# EAGLE board BMSBoard (EAGLE 9.1.3)
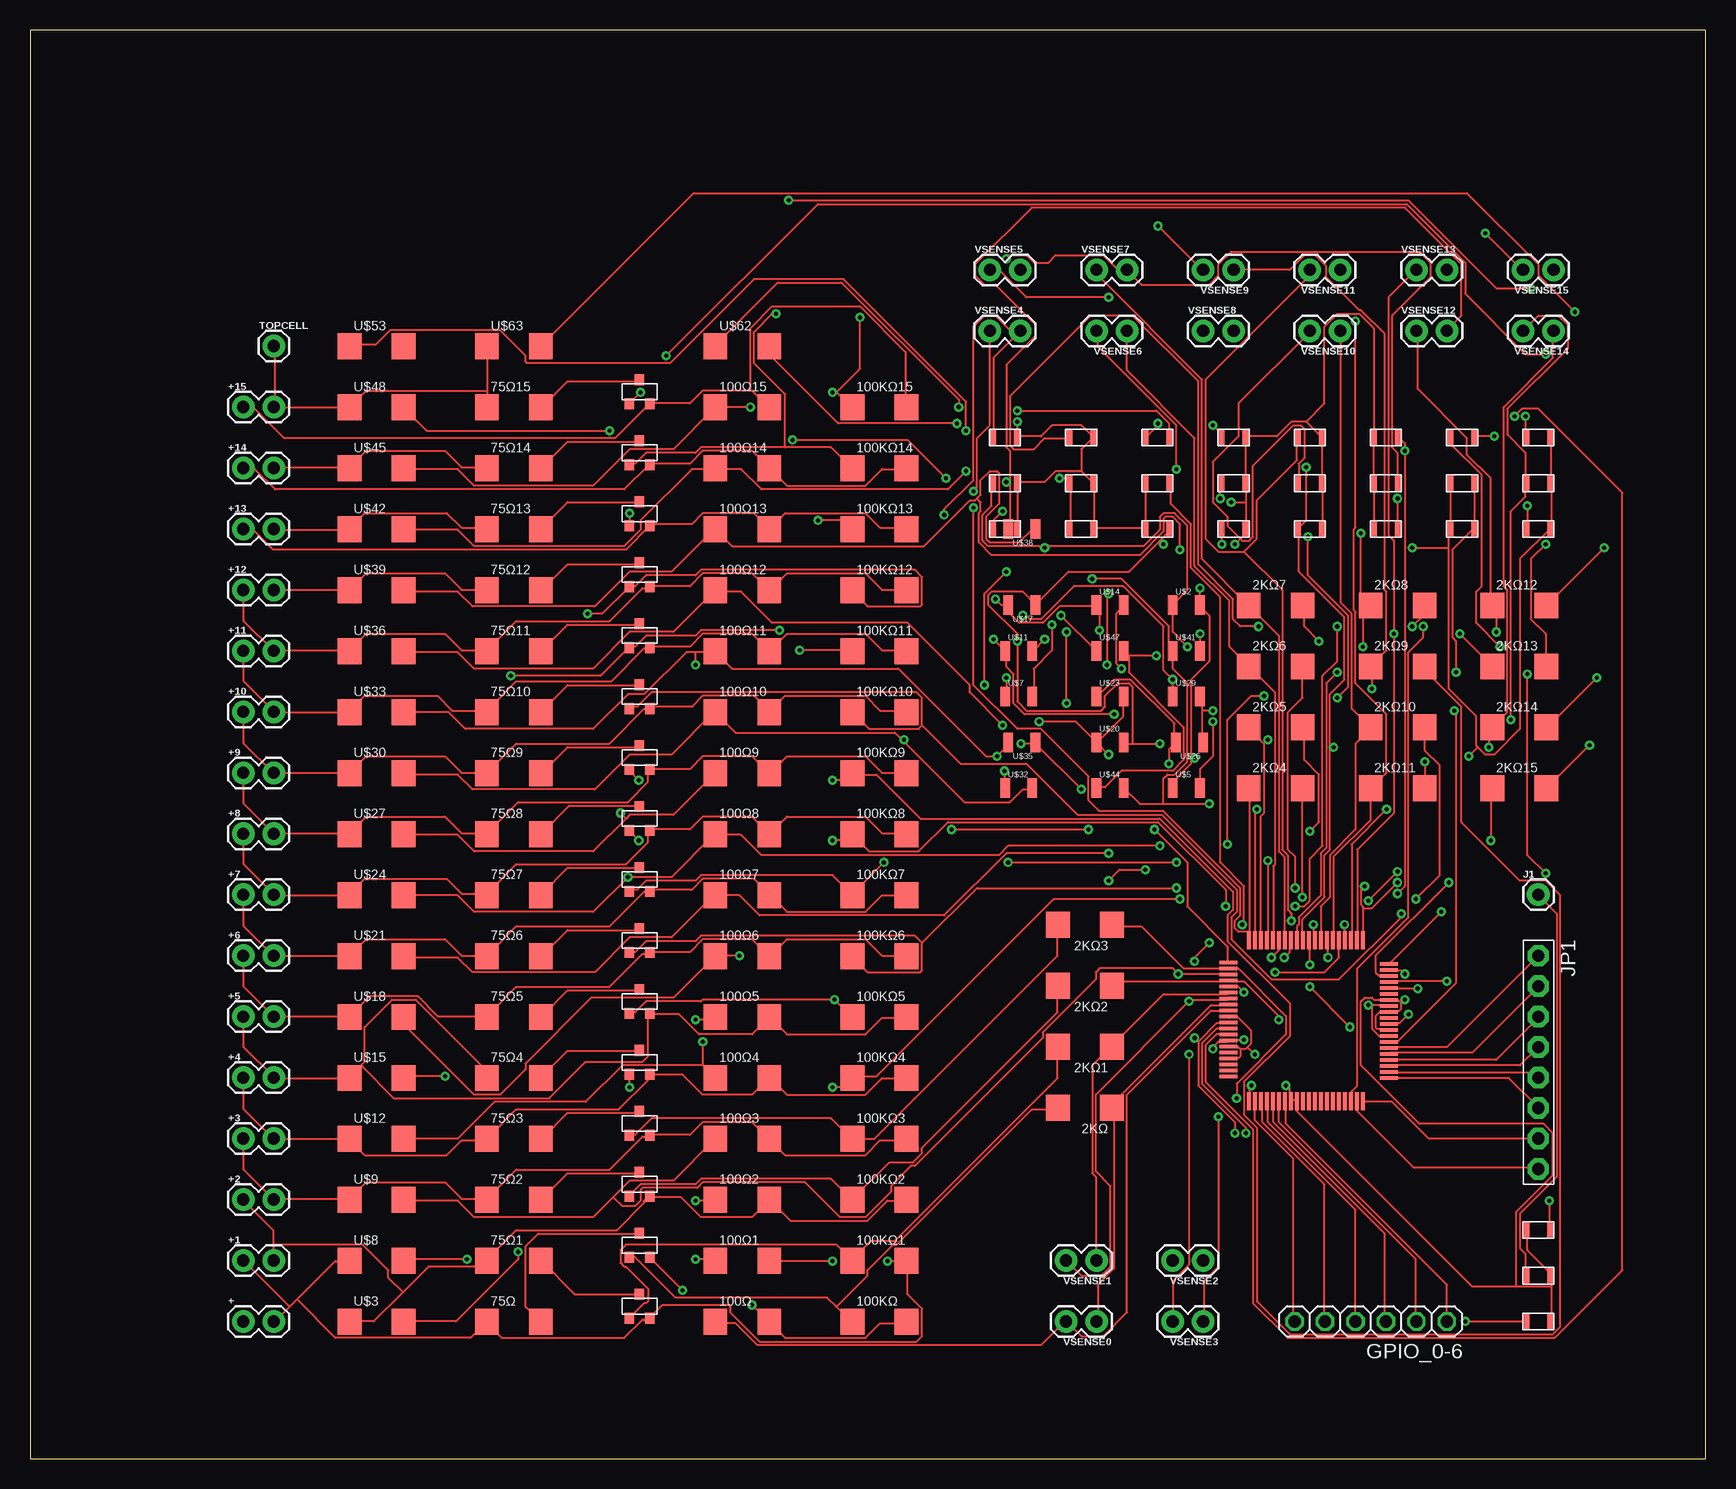
[diagram p2: board, top side]
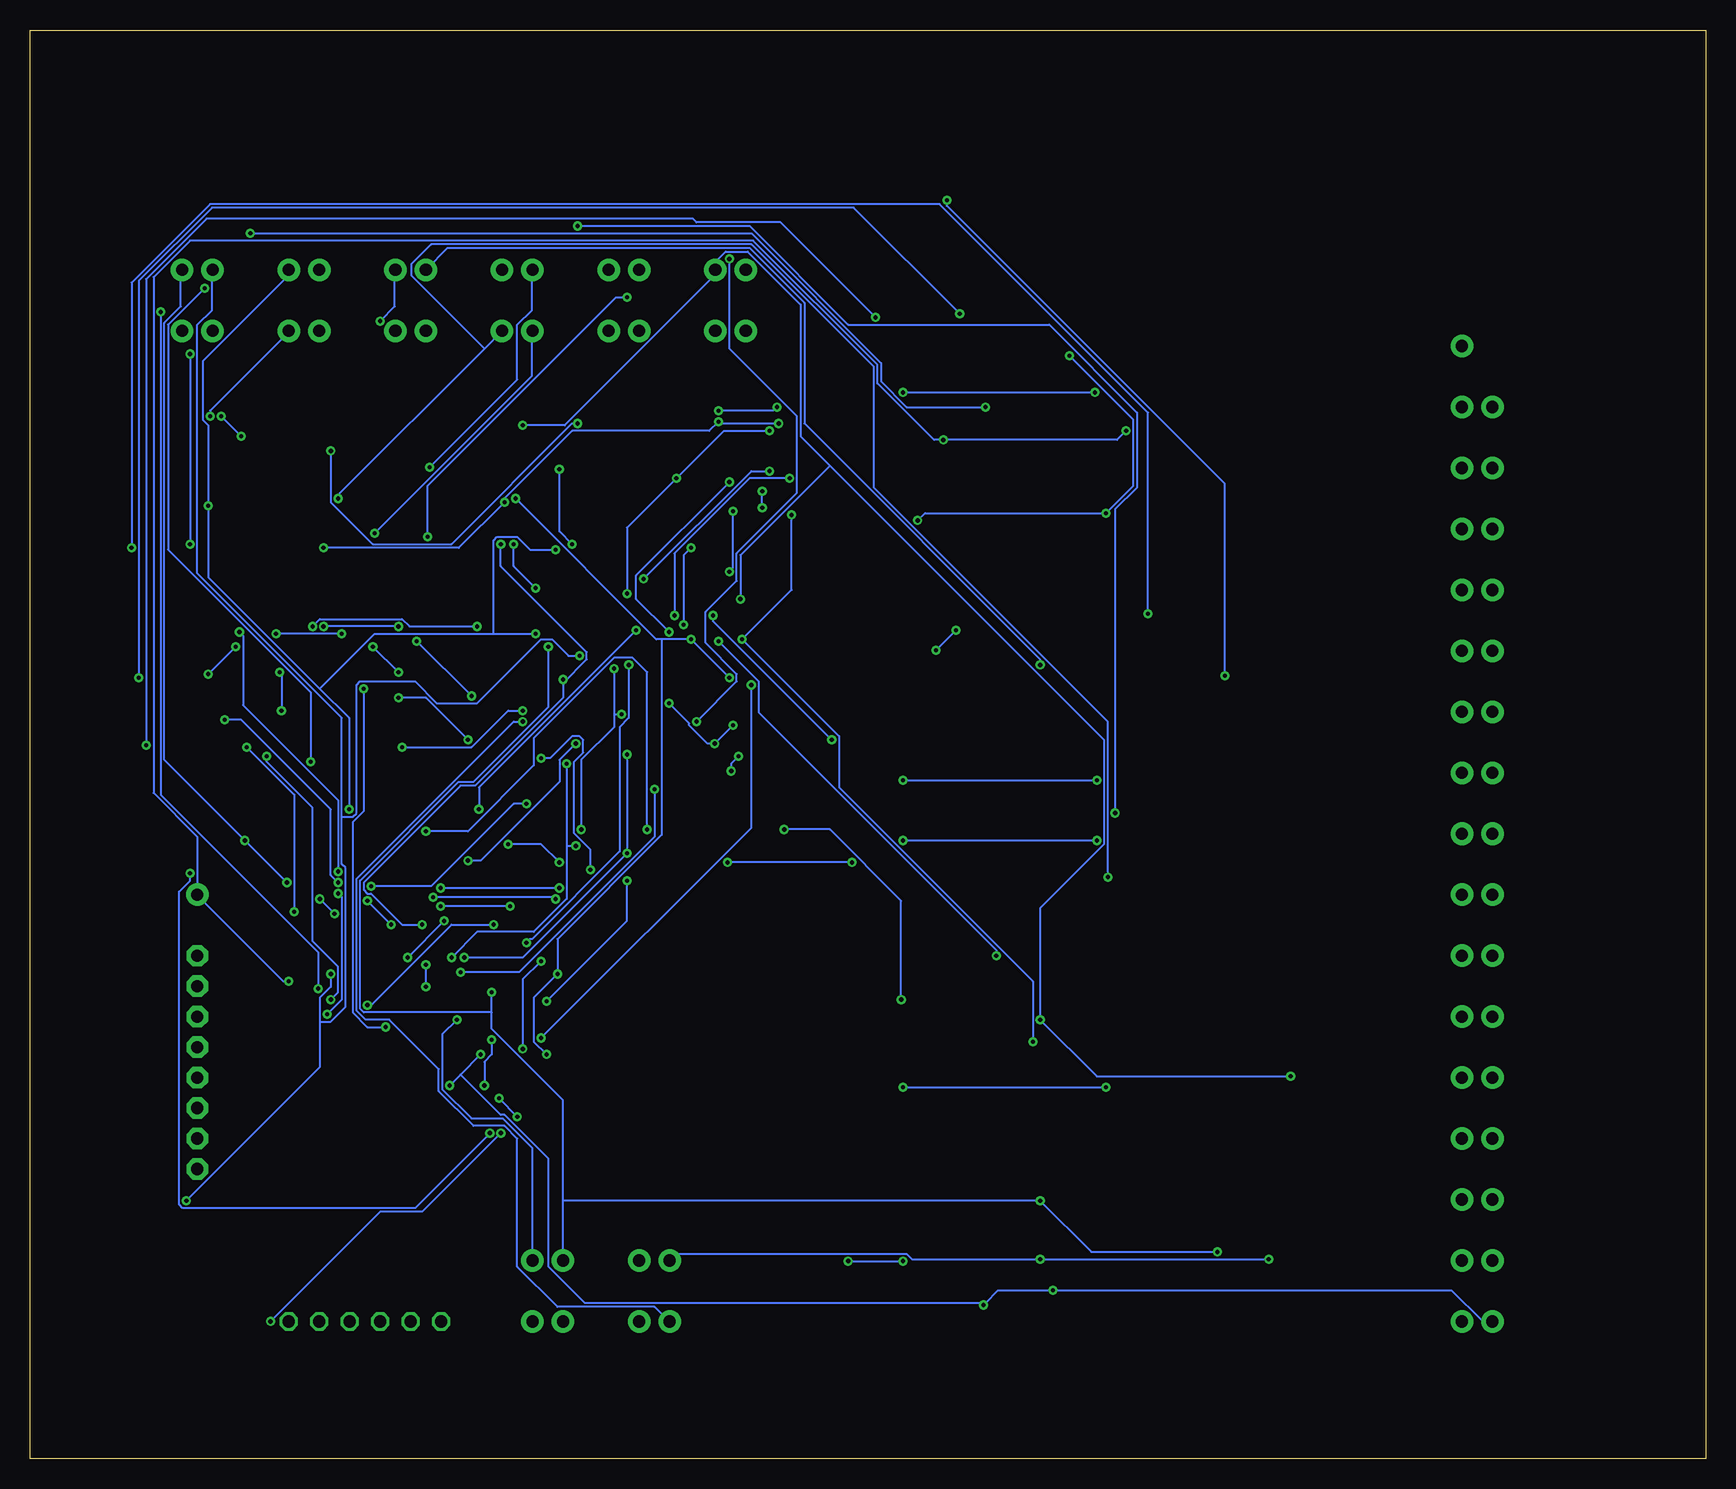
[diagram p3: board, bottom side, seen from below]

Size 139.68 x 119.05 mm. Coordinates in mm from the lower left corner, seen from the top.
Outline: 0,0 139.68,0 139.68,119.05 0,119.05 0,0
Copper layers (1*16): Top 0.035mm / dielectric 1.5mm / Bottom 0.035mm
Design rules "default": minimum track width 6mil, minimum drill 0.35mm, track to track 6mil, track to pad 6mil, pad to pad 6mil, via to via 6mil, smd to smd 6mil, copper to edge 40mil, drill to drill 6mil, minimum pad ring 10mil, minimum via ring 8mil, stop-mask expansion 4mil, vias tented up to drill 0mil, thermal gap 10mil

## Footprints (pad centres in the part's own frame; a part is rotated, then mirrored left to right if it is on the bottom)
CL21B105KBFNNNG = smd 0.5 x 1.35: P$1 -1,0; P$2 1,0
PWR3014W1000JE = smd 1.98 x 2.16: P$1 -0.02,-0.03; P$2 4.48,-0.03
1X02 = drill 1.016 pad 1.88: 1 0,0; 2 2.54,0
1X06 = drill 1.016 octagon: 1 -6.35,0; 2 -3.81,0; 3 -1.27,0; 4 1.27,0; 5 3.81,0; 6 6.35,0
1X01 = drill 1.016 pad 1.88: 1 0,0
1X08-BIG = drill 1.016 pad 1.778 octagon: 1 -8.89,0; 2 -6.35,0; 3 -3.81,0; 4 -1.27,0; 5 1.27,0; 6 3.81,0; 7 6.35,0; 8 8.89,0
2V7002KT1G = smd 0.8 x 0.9: P$1 -0.85,-1; P$2 0,1; P$3 0.85,-1
SOD-123-2 = smd 0.81 x 1.62: P$1 0,0; P$2 2.27,0
BQ76PL455A-Q1 = smd 1.5 x 0.3: P$1 0,9.5; P$2 0,9; P$3 0,8.5; P$4 0,8; P$5 0,7.5; P$6 0,7; P$7 0,6.5; P$8 0,6; P$9 0,5.5; P$10 0,5; P$11 0,4.5; P$12 0,4; P$13 0,3.5; P$14 0,3; P$15 0,2.5; P$16 0,2; P$17 0,1.5; P$18 0,1; P$19 0,0.5; P$20 0,0; P$41 13.4,0; P$42 13.4,0.5; P$43 13.4,1; P$44 13.4,1.5; P$45 13.4,2; P$46 13.4,2.5; P$47 13.4,3; P$48 13.4,3.5; P$49 13.4,4; P$50 13.4,4.5; P$51 13.4,5; P$52 13.4,5.5; P$53 13.4,6; P$54 13.4,6.5; P$55 13.4,7; P$56 13.4,7.5; P$57 13.4,8; P$58 13.4,8.5; P$59 13.4,9; P$60 13.4,9.5 | smd 0.3 x 1.5: P$21 1.85,-1.7; P$22 2.35,-1.7; P$23 2.85,-1.7; P$24 3.35,-1.7; P$25 3.85,-1.7; P$26 4.35,-1.7; P$27 4.85,-1.7; P$28 5.35,-1.7; P$29 5.85,-1.7; P$30 6.35,-1.7; P$31 6.85,-1.7; P$32 7.35,-1.7; P$33 7.85,-1.7; P$34 8.35,-1.7; P$35 8.85,-1.7; P$36 9.35,-1.7; P$37 9.85,-1.7; P$38 10.35,-1.7; P$39 10.85,-1.7; P$40 11.35,-1.7; P$61 11.45,11.65; P$62 10.95,11.65; P$63 10.45,11.65; P$64 9.95,11.65; P$65 9.45,11.65; P$66 8.95,11.65; P$67 8.45,11.65; P$68 7.95,11.65; P$69 7.45,11.65; P$70 6.95,11.65; P$71 6.45,11.65; P$72 5.95,11.65; P$73 5.45,11.65; P$74 4.95,11.65; P$75 4.45,11.65; P$76 3.95,11.65; P$77 3.45,11.65; P$78 2.95,11.65; P$79 2.45,11.65; P$80 1.95,11.65

## Placement (x,y rotation side)
1UF  1uF  [CL21B105KBFNNNG]  100.33,77.47 0 top
1UF1  1uF  [CL21B105KBFNNNG]  81.28,81.28 0 top
1UF2  1uF  [CL21B105KBFNNNG]  100.33,81.28 0 top
1UF3  1uF  [CL21B105KBFNNNG]  81.28,85.09 0 top
1UF4  1uF  [CL21B105KBFNNNG]  100.33,85.09 0 top
1UF5  1uF  [CL21B105KBFNNNG]  93.98,77.47 180 top
1UF6  1uF  [CL21B105KBFNNNG]  113.03,81.28 180 top
1UF7  1uF  [CL21B105KBFNNNG]  113.03,77.47 180 top
1UF8  1uF  [CL21B105KBFNNNG]  106.68,77.47 0 top
1UF9  1uF  [CL21B105KBFNNNG]  106.68,81.28 0 top
1UF10  1uF  [CL21B105KBFNNNG]  106.68,85.09 0 top
1UF11  1uF  [CL21B105KBFNNNG]  125.73,85.09 0 top
1UF12  1uF  [CL21B105KBFNNNG]  125.73,77.47 0 top
1UF13  1uF  [CL21B105KBFNNNG]  125.73,81.28 0 top
1UF14  1uF  [CL21B105KBFNNNG]  125.73,19.05 180 top
1UF15  1uF  [CL21B105KBFNNNG]  125.73,15.24 0 top
2KΩ  2kΩ  [PWR3014W1000JE]  90.17,29.21 180 top
2KΩ1  2kΩ  [PWR3014W1000JE]  90.17,34.29 180 top
2KΩ2  2kΩ  [PWR3014W1000JE]  90.17,39.37 180 top
2KΩ3  2kΩ  [PWR3014W1000JE]  90.17,44.45 180 top
2KΩ4  2kΩ  [PWR3014W1000JE]  101.6,55.88 0 top
2KΩ5  2kΩ  [PWR3014W1000JE]  101.6,60.96 0 top
2KΩ6  2kΩ  [PWR3014W1000JE]  101.6,66.04 0 top
2KΩ7  2kΩ  [PWR3014W1000JE]  101.6,71.12 0 top
2KΩ8  2kΩ  [PWR3014W1000JE]  111.76,71.12 0 top
2KΩ9  2kΩ  [PWR3014W1000JE]  111.76,66.04 0 top
2KΩ10  2kΩ  [PWR3014W1000JE]  111.76,60.96 0 top
2KΩ11  2kΩ  [PWR3014W1000JE]  111.76,55.88 0 top
2KΩ12  2kΩ  [PWR3014W1000JE]  121.92,71.12 0 top
2KΩ13  2kΩ  [PWR3014W1000JE]  121.92,66.04 0 top
2KΩ14  2kΩ  [PWR3014W1000JE]  121.92,60.96 0 top
2KΩ15  2kΩ  [PWR3014W1000JE]  121.92,55.88 0 top
75Ω  75Ω  [PWR3014W1000JE]  38.1,11.43 0 top
75Ω1  75Ω  [PWR3014W1000JE]  38.1,16.51 0 top
75Ω2  75Ω  [PWR3014W1000JE]  38.1,21.59 0 top
75Ω3  75Ω  [PWR3014W1000JE]  38.1,26.67 0 top
75Ω4  75Ω  [PWR3014W1000JE]  38.1,31.75 0 top
75Ω5  75Ω  [PWR3014W1000JE]  38.1,36.83 0 top
75Ω6  75Ω  [PWR3014W1000JE]  38.1,41.91 0 top
75Ω7  75Ω  [PWR3014W1000JE]  38.1,46.99 0 top
75Ω8  75Ω  [PWR3014W1000JE]  38.1,52.07 0 top
75Ω9  75Ω  [PWR3014W1000JE]  38.1,57.15 0 top
75Ω10  75Ω  [PWR3014W1000JE]  38.1,62.23 0 top
75Ω11  75Ω  [PWR3014W1000JE]  38.1,67.31 0 top
75Ω12  75Ω  [PWR3014W1000JE]  38.1,72.39 0 top
75Ω13  75Ω  [PWR3014W1000JE]  38.1,77.47 0 top
75Ω14  75Ω  [PWR3014W1000JE]  38.1,82.55 0 top
75Ω15  75Ω  [PWR3014W1000JE]  38.1,87.63 0 top
100KΩ  100kΩ  [PWR3014W1000JE]  68.58,11.43 0 top
100KΩ1  100kΩ  [PWR3014W1000JE]  68.58,16.51 0 top
100KΩ2  100kΩ  [PWR3014W1000JE]  68.58,21.59 0 top
100KΩ3  100kΩ  [PWR3014W1000JE]  68.58,26.67 0 top
100KΩ4  100kΩ  [PWR3014W1000JE]  68.58,31.75 0 top
100KΩ5  100kΩ  [PWR3014W1000JE]  68.58,36.83 0 top
100KΩ6  100kΩ  [PWR3014W1000JE]  68.58,41.91 0 top
100KΩ7  100kΩ  [PWR3014W1000JE]  68.58,46.99 0 top
100KΩ8  100kΩ  [PWR3014W1000JE]  68.58,52.07 0 top
100KΩ9  100kΩ  [PWR3014W1000JE]  68.58,57.15 0 top
100KΩ10  100kΩ  [PWR3014W1000JE]  68.58,62.23 0 top
100KΩ11  100kΩ  [PWR3014W1000JE]  68.58,67.31 0 top
100KΩ12  100kΩ  [PWR3014W1000JE]  68.58,72.39 0 top
100KΩ13  100kΩ  [PWR3014W1000JE]  68.58,77.47 0 top
100KΩ14  100kΩ  [PWR3014W1000JE]  68.58,82.55 0 top
100KΩ15  100kΩ  [PWR3014W1000JE]  68.58,87.63 0 top
100Ω  100Ω  [PWR3014W1000JE]  57.15,11.43 0 top
100Ω1  100Ω  [PWR3014W1000JE]  57.15,16.51 0 top
100Ω2  100Ω  [PWR3014W1000JE]  57.15,21.59 0 top
100Ω3  100Ω  [PWR3014W1000JE]  57.15,26.67 0 top
100Ω4  100Ω  [PWR3014W1000JE]  57.15,31.75 0 top
100Ω5  100Ω  [PWR3014W1000JE]  57.15,36.83 0 top
100Ω6  100Ω  [PWR3014W1000JE]  57.15,41.91 0 top
100Ω7  100Ω  [PWR3014W1000JE]  57.15,46.99 0 top
100Ω8  100Ω  [PWR3014W1000JE]  57.15,52.07 0 top
100Ω9  100Ω  [PWR3014W1000JE]  57.15,57.15 0 top
100Ω10  100Ω  [PWR3014W1000JE]  57.15,62.23 0 top
100Ω11  100Ω  [PWR3014W1000JE]  57.15,67.31 0 top
100Ω12  100Ω  [PWR3014W1000JE]  57.15,72.39 0 top
100Ω13  100Ω  [PWR3014W1000JE]  57.15,77.47 0 top
100Ω14  100Ω  [PWR3014W1000JE]  57.15,82.55 0 top
100Ω15  100Ω  [PWR3014W1000JE]  57.15,87.63 0 top
+  -  [1X02]  17.78,11.43 0 top
+1  -  [1X02]  17.78,16.51 0 top
+2  -  [1X02]  17.78,21.59 0 top
+3  -  [1X02]  17.78,26.67 0 top
+4  -  [1X02]  17.78,31.75 0 top
+5  -  [1X02]  17.78,36.83 0 top
+6  -  [1X02]  17.78,41.91 0 top
+7  -  [1X02]  17.78,46.99 0 top
+8  -  [1X02]  17.78,52.07 0 top
+9  -  [1X02]  17.78,57.15 0 top
+10  -  [1X02]  17.78,62.23 0 top
+11  -  [1X02]  17.78,67.31 0 top
+12  -  [1X02]  17.78,72.39 0 top
+13  -  [1X02]  17.78,77.47 0 top
+14  -  [1X02]  17.78,82.55 0 top
+15  -  [1X02]  17.78,87.63 0 top
GPIO_0-6  [1X06]  111.76,11.43 180 top
J1  VSENSE16  [1X01]  125.73,46.99 0 top
JP1  [1X08-BIG]  125.73,33.02 270 top
TOPCELL  [1X01]  20.32,92.71 0 top
U$1  2V7002KT1G  [2V7002KT1G]  50.8,12.7 0 top
U$2  6.2V  [SOD-123-2]  95.25,71.12 0 top
U$3  100Ω  [PWR3014W1000JE]  26.67,11.43 0 top
U$4  2V7002KT1G  [2V7002KT1G]  50.8,17.78 0 top
U$5  6.2V  [SOD-123-2]  95.25,55.88 0 top
U$6  2V7002KT1G  [2V7002KT1G]  50.8,22.86 0 top
U$7  6.2V  [SOD-123-2]  81.28,63.5 0 top
U$8  100Ω  [PWR3014W1000JE]  26.67,16.51 0 top
U$9  100Ω  [PWR3014W1000JE]  26.67,21.59 0 top
U$10  2V7002KT1G  [2V7002KT1G]  50.8,27.94 0 top
U$11  6.2V  [SOD-123-2]  81.28,67.31 0 top
U$12  100Ω  [PWR3014W1000JE]  26.67,26.67 0 top
U$13  2V7002KT1G  [2V7002KT1G]  50.8,33.02 0 top
U$14  6.2V  [SOD-123-2]  88.9,71.12 0 top
U$15  100Ω  [PWR3014W1000JE]  26.67,31.75 0 top
U$16  2V7002KT1G  [2V7002KT1G]  50.8,38.1 0 top
U$17  6.2V  [SOD-123-2]  83.82,71.12 180 top
U$18  100Ω  [PWR3014W1000JE]  26.67,36.83 0 top
U$19  2V7002KT1G  [2V7002KT1G]  50.8,43.18 0 top
U$20  6.2V  [SOD-123-2]  88.9,59.69 0 top
U$21  100Ω  [PWR3014W1000JE]  26.67,41.91 0 top
U$22  2V7002KT1G  [2V7002KT1G]  50.8,48.26 0 top
U$23  6.2V  [SOD-123-2]  88.9,63.5 0 top
U$24  100Ω  [PWR3014W1000JE]  26.67,46.99 0 top
U$25  2V7002KT1G  [2V7002KT1G]  50.8,53.34 0 top
U$26  6.2V  [SOD-123-2]  97.79,59.69 180 top
U$27  100Ω  [PWR3014W1000JE]  26.67,52.07 0 top
U$28  2V7002KT1G  [2V7002KT1G]  50.8,58.42 0 top
U$29  6.2V  [SOD-123-2]  95.25,63.5 0 top
U$30  100Ω  [PWR3014W1000JE]  26.67,57.15 0 top
U$31  2V7002KT1G  [2V7002KT1G]  50.8,63.5 0 top
U$32  6.2V  [SOD-123-2]  81.28,55.88 0 top
U$33  100Ω  [PWR3014W1000JE]  26.67,62.23 0 top
U$34  2V7002KT1G  [2V7002KT1G]  50.8,68.58 0 top
U$35  6.2V  [SOD-123-2]  83.82,59.69 180 top
U$36  100Ω  [PWR3014W1000JE]  26.67,67.31 0 top
U$37  2V7002KT1G  [2V7002KT1G]  50.8,73.66 0 top
U$38  6.2V  [SOD-123-2]  83.82,77.47 180 top
U$39  100Ω  [PWR3014W1000JE]  26.67,72.39 0 top
U$40  2V7002KT1G  [2V7002KT1G]  50.8,78.74 0 top
U$41  6.2V  [SOD-123-2]  95.25,67.31 0 top
U$42  100Ω  [PWR3014W1000JE]  26.67,77.47 0 top
U$43  2V7002KT1G  [2V7002KT1G]  50.8,83.82 0 top
U$44  6.2V  [SOD-123-2]  88.9,55.88 0 top
U$45  100Ω  [PWR3014W1000JE]  26.67,82.55 0 top
U$46  2V7002KT1G  [2V7002KT1G]  50.8,88.9 0 top
U$47  6.2V  [SOD-123-2]  88.9,67.31 0 top
U$48  100Ω  [PWR3014W1000JE]  26.67,87.63 0 top
U$49  BQ76PL455A-Q1  [BQ76PL455A-Q1]  101.6,43.18 270 top
U$50  22nF  [CL21B105KBFNNNG]  119.38,85.09 0 top
U$51  CL21B105KBFNNNG  [CL21B105KBFNNNG]  125.73,11.43 0 top
U$52  CL21B105KBFNNNG  [CL21B105KBFNNNG]  81.28,77.47 0 top
U$53  1Ω  [PWR3014W1000JE]  26.67,92.71 0 top
U$54  CL21B105KBFNNNG  [CL21B105KBFNNNG]  87.63,77.47 0 top
U$55  CL21B105KBFNNNG  [CL21B105KBFNNNG]  87.63,81.28 0 top
U$56  CL21B105KBFNNNG  [CL21B105KBFNNNG]  87.63,85.09 0 top
U$57  CL21B105KBFNNNG  [CL21B105KBFNNNG]  119.38,77.47 0 top
U$58  CL21B105KBFNNNG  [CL21B105KBFNNNG]  119.38,81.28 0 top
U$59  CL21B105KBFNNNG  [CL21B105KBFNNNG]  93.98,81.28 0 top
U$60  CL21B105KBFNNNG  [CL21B105KBFNNNG]  113.03,85.09 0 top
U$61  CL21B105KBFNNNG  [CL21B105KBFNNNG]  93.98,85.09 180 top
U$62  PWR3014W1000JE  [PWR3014W1000JE]  57.15,92.71 0 top
U$63  PWR3014W1000JE  [PWR3014W1000JE]  38.1,92.71 0 top
VSENSE0  EQ1  [1X02]  88.9,11.43 180 top
VSENSE1  EQ1  [1X02]  88.9,16.51 180 top
VSENSE2  EQ1  [1X02]  97.79,16.51 180 top
VSENSE3  EQ1  [1X02]  97.79,11.43 180 top
VSENSE4  EQ1  [1X02]  80.01,93.98 0 top
VSENSE5  EQ1  [1X02]  80.01,99.06 0 top
VSENSE6  EQ1  [1X02]  91.44,93.98 180 top
VSENSE7  EQ1  [1X02]  88.9,99.06 0 top
VSENSE8  EQ1  [1X02]  97.79,93.98 0 top
VSENSE9  EQ1  [1X02]  100.33,99.06 180 top
VSENSE10  EQ1  [1X02]  109.22,93.98 180 top
VSENSE11  EQ1  [1X02]  109.22,99.06 180 top
VSENSE12  EQ1  [1X02]  115.57,93.98 0 top
VSENSE13  EQ1  [1X02]  115.57,99.06 0 top
VSENSE14  EQ1  [1X02]  127,93.98 180 top
VSENSE15  EQ1  [1X02]  127,99.06 180 top

## Tracks (layer width: path | path; a pad name or v marks a point on that pad's centre or on a via)
AUX0
  Top 0.152: JP1.1 118.11,34.29 113.39,34.29 U$49.P$66
AUX1
  Top 0.152: U$49.P$65 113.39,33.83 120.24,33.83 125.73,39.32 JP1.2
AUX2
  Top 0.152: U$49.P$64 113.39,33.22 122.22,33.22 125.73,36.73 JP1.3
AUX3
  Top 0.152: JP1.4 124.21,32.77 113.39,32.77 U$49.P$63
AUX4
  Top 0.152: U$49.P$62 113.39,32.16 125.42,32.16 125.73,31.85 JP1.5
AUX5
  Top 0.152: U$49.P$61 113.39,31.7 123.29,31.7 125.73,29.26 JP1.6
AUX6
  Top 0.152: JP1.7 116.59,26.67 113.54,29.72 111.1,29.72 U$49.P$60
AUX7
  Top 0.152: U$49.P$59 110.64,29.72 110.64,28.96 115.37,24.23 125.73,24.23 JP1.8
BATCON1,2
  Top 0.152: 100KΩ4.P$2 73,31.7 71.02,31.7 69.65,30.33 63.09,30.33 61.72,31.7 100Ω4.P$2 61.57,31.7 60.2,30.33 56.08,30.33 54.41,32 51.66,32 U$13.P$3 51.51,32 51.51,31.55 49.07,29.11 40.54,29.11 38.1,26.67 75Ω3.P$1 37.95,26.52 35.97,26.52 34.75,25.3 27.89,25.3 26.67,26.52 U$12.P$1 26.52,26.67 +3.2 20.27,26.67 17.83,29.11 17.83,31.7 +4.1
BATCON2,3
  Top 0.152: 100KΩ8.P$2 73,52.12 71.02,52.12 69.65,53.49 63.09,53.49 61.72,52.12 100Ω8.P$2 61.57,52.12 60.2,53.49 56.08,53.49 55.02,52.43 51.66,52.43 U$25.P$3 51.51,52.27 51.51,51.36 49.68,49.53 40.54,49.53 38.1,47.09 75Ω7.P$1 37.95,47.09 35.97,47.09 34.75,48.31 27.89,48.31 26.67,47.09 U$24.P$1 26.52,46.94 20.42,46.94 +7.2 20.27,47.09 17.83,49.53 17.83,51.97 +8.1
BATCON3,4
  Top 0.152: 100KΩ12.P$2 73,72.39 71.02,72.39 69.65,73.76 63.09,73.76 61.72,72.39 100Ω12.P$2 61.57,72.39 60.2,73.76 56.08,73.76 55.02,72.69 51.66,72.69 U$37.P$3 51.51,72.54 51.05,72.54 48.31,69.8 40.54,69.8 38.1,67.36 75Ω11.P$1 37.95,67.36 35.97,67.36 34.59,68.73 28.04,68.73 26.67,67.36 U$36.P$1 26.52,67.36 20.42,67.36 +11.2 17.83,69.8 17.83,72.39 +12.1
EQ1
  Top 0.152: U$49.P$28 99.82,37.8 98.45,37.8 90.22,29.57 90.22,29.26 2KΩ.P$1 90.22,29.11 90.37,28.96 90.37,15.85 89,14.48 89,11.43 VSENSE0.1
EQ2
  Top 0.152: U$49.P$26 99.82,38.71 94.49,38.71 90.22,34.44 2KΩ1.P$1 90.07,34.29 88.54,32.77 88.54,23.77 88.85,23.47 88.85,16.61 VSENSE1.1
EQ3  (via drill 0.35)
  Top 0.152: 2KΩ2.P$1 90.22,39.47 90.53,39.78 99.82,39.78 U$49.P$24 99.97,39.78 101.19,39.78 104.09,36.88 v104.09,36.58
  Bottom 0.152: v104.09,36.58 105.31,35.36 105.31,30.79 102.87,28.35 100.28,28.35 97.84,25.91 97.84,16.61 VSENSE2.1
EQ4  (via drill 0.35)
  Top 0.152: 2KΩ3.P$1 90.22,44.35 92.66,44.35 96.16,40.84 99.82,40.84 U$49.P$22 99.97,40.84 100.74,40.84 104.7,36.88 104.7,35.36 100.58,31.24 v100.58,30.02 | v99.06,28.5 99.06,16 97.84,14.78 97.84,11.43 VSENSE3.1
  Bottom 0.152: v100.58,30.02 v99.06,28.5
EQ5  (via drill 0.35)
  Top 0.152: 101.65,43.89 101.65,55.78 2KΩ4.P$1 | 101.65,43.89 101.65,43.28 U$49.P$20 101.65,43.89 | VSENSE4.1 80.01,86.11 78.94,85.04 78.94,80.92 v78.64,80.62 | v78.64,79.25 78.64,64.47 82.3,60.81 84.28,60.81 88.24,56.84 88.24,54.86 89.15,53.95 94.49,53.95 100.89,47.55 100.89,45.26 100.43,44.81 100.43,44.2 100.74,43.89 101.65,43.89
  Bottom 0.152: v78.64,79.25 v78.64,80.62
EQ6  (via drill 0.35)
  Top 0.152: 102.87,59.59 102.87,53.8 102.56,53.49 102.56,43.28 U$49.P$18 | 102.87,59.59 101.65,60.81 2KΩ5.P$1 | VSENSE5.1 80.77,99.06 83.06,96.77 v89.92,96.77 | v106.53,76.81 106.53,73.61 109.88,70.26 109.88,64.31 v108.97,63.4 | 102.87,59.59 v103.17,59.89
  Bottom 0.152: v89.92,96.77 90.83,96.77 106.53,81.08 v106.53,76.81 | v108.97,63.4 106.68,63.4 v103.17,59.89
EQ7
  Top 0.152: U$49.P$16 103.63,43.28 103.63,49.38 103.78,49.53 103.78,63.86 101.65,65.99 2KΩ6.P$1 101.5,66.14 99.97,67.67 99.97,71.48 97.08,74.37 97.08,85.04 91.44,90.68 VSENSE6.1
EQ8
  Top 0.152: U$49.P$14 104.55,43.28 104.55,50.14 104.09,50.6 104.09,68.58 101.65,71.02 2KΩ7.P$1 101.5,71.17 97.69,74.98 97.69,89.92 89,98.6 89,99.06 VSENSE7.1
EQ9  (via drill 0.35)
  Top 0.152: v108.97,65.53 108.05,64.62 108.05,50.9 107.59,50.44 107.59,46.94 105.77,45.11 105.77,44.5 105.61,44.35 105.61,43.28 U$49.P$12 | v111.1,67.67 111.1,70.41 111.71,71.02 2KΩ8.P$1 111.71,71.17 110.95,71.93 v110.95,77.11
  Bottom 0.152: v111.1,67.67 v108.97,65.53 | v110.95,77.11 97.84,90.22 97.84,93.88 VSENSE8.1
EQ10  (via drill 0.35)
  Top 0.152: v106.68,41.15 106.68,43.13 U$49.P$10 | v110.03,35.97 v106.68,39.32 | v111.86,64.16 111.86,65.99 2KΩ9.P$1 111.86,66.14 113.08,67.36 113.08,72.24 112.93,72.39 112.93,93.73 110.95,95.71 110.8,95.71 108.05,98.45 108.05,99.36 107.14,100.28 106.22,100.28 105,99.06 VSENSE9.1
  Bottom 0.152: v106.68,39.32 v106.68,41.15 | v110.03,35.97 111.56,35.97 112.78,37.19 112.78,53.03 111.86,53.95 v111.86,64.16
EQ11
  Top 0.152: U$49.P$8 107.59,43.28 107.59,46.02 108.36,46.79 108.36,50.29 110.49,52.43 110.49,59.59 111.71,60.81 2KΩ10.P$1 111.71,60.96 110.19,62.48 110.19,70.41 109.27,71.32 109.27,93.88 VSENSE10.1
EQ12  (via drill 0.35)
  Top 0.152: U$49.P$6 108.66,43.28 108.66,50.14 111.71,53.19 111.71,55.78 2KΩ11.P$1 111.86,55.93 113.08,57.15 113.08,62.03 110.49,64.62 110.49,70.56 110.34,70.71 110.34,77.42 110.49,77.57 v110.49,94.79
  Bottom 0.152: v110.49,94.79 109.27,96.01 109.27,99.06 VSENSE11.1
EQ13  (via drill 0.35)
  Top 0.152: v109.58,44.5 109.58,43.28 U$49.P$4 | v114,48.92 v111.56,46.48 | v122.22,68.89 122.22,70.71 121.92,71.02 2KΩ12.P$1 121.77,71.17 121.77,81.69 119.79,83.67 119.79,85.04 115.67,89.15 115.67,93.88 VSENSE12.1
  Bottom 0.152: v111.56,46.48 v109.58,44.5 | v114,48.92 114,54.86 121.92,62.79 121.92,68.58 v122.22,68.89
EQ14  (via drill 0.35)
  Top 0.152: U$49.P$2 110.64,43.28 110.64,50.75 113.69,53.8 v113.69,68.73 113.69,76.5 113.23,76.96 113.23,96.77 115.52,99.06 VSENSE13.1 | v119.18,68.73 121.77,66.14 2KΩ13.P$1
  Bottom 0.152: v113.69,68.73 v119.18,68.73
EQ15  (via drill 0.35)
  Top 0.152: v117.65,45.57 113.39,41.3 U$49.P$80 | v121.61,59.28 121.61,60.66 121.77,60.81 2KΩ14.P$1 121.92,60.96 123.14,62.18 123.14,72.39 122.83,72.69 122.83,87.63 126.95,91.75 126.95,93.88 VSENSE14.1
  Bottom 0.152: v117.65,45.57 117.65,55.32 v121.61,59.28
EQ16  (via drill 0.35)
  Top 0.152: v118.26,48.01 112.17,41.91 112.17,40.54 112.47,40.23 113.23,40.23 U$49.P$78 | v121.77,51.51 121.77,55.78 2KΩ15.P$1
  Bottom 0.152: v118.26,48.01 v121.77,51.51 128.47,58.22 128.47,94.64 127.1,96.01 127.1,99.06 VSENSE15.1
GND  (via drill 0.35)
  Top 0.152: U$58.P$1 118.42,81.23 118.42,77.57 U$57.P$1 118.26,77.42 118.26,75.89 | 1UF11.P$2 126.8,85.04 126.8,81.38 1UF13.P$2 126.8,81.23 126.8,77.57 1UF12.P$2 126.64,77.42 124.21,74.98 124.21,60.81 122.07,58.67 121.31,58.67 120.7,59.28 | 118.26,75.89 118.26,64.16 120.55,61.87 120.55,59.44 120.7,59.28 | 1UF7.P$2 112.01,77.57 112.01,81.23 1UF6.P$2 112.01,81.38 112.01,85.04 U$60.P$1 112.01,85.19 112.01,94.18 110.8,95.4 108.97,95.4 107.9,94.34 107.9,87.94 106.38,86.41 | 101.35,79.7 101.35,81.23 1UF2.P$2 101.35,81.38 101.35,85.04 1UF4.P$2 101.35,85.19 103.94,85.19 105.16,86.41 106.38,86.41 | 101.35,79.7 101.35,77.57 1UF.P$2 | 1UF8.P$2 107.75,77.57 107.75,81.23 1UF9.P$2 107.75,81.38 107.75,85.04 1UF10.P$2 107.59,85.19 106.38,86.41 | 92.96,77.57 92.96,81.23 U$59.P$1 | U$52.P$2 82.3,77.57 82.3,81.23 1UF1.P$2 82.3,81.38 84.58,81.38 85.5,82.3 87.63,82.3 | 88.7,77.57 88.7,81.23 U$55.P$2 88.54,81.38 87.63,82.3 | 88.7,77.57 92.96,77.57 | 92.96,77.57 1UF5.P$2 | 88.7,77.57 U$54.P$2 | 82.3,85.19 84.28,85.19 85.19,86.11 87.63,86.11 88.54,85.19 U$56.P$2 88.54,85.04 87.63,84.12 87.63,82.3 | v77.27,86.26 67.36,86.26 61.72,91.9 61.72,92.66 U$62.P$2 | 82.3,85.19 v82.3,86.41 | 82.3,85.19 1UF3.P$2 | v100.13,79.7 101.35,79.7 | v115.21,75.89 118.26,75.89 | 100.89,34.14 100.89,33.53 100.74,33.38 99.97,33.38 U$49.P$37 | 100.89,34.14 100.74,34.29 99.97,34.29 U$49.P$35 | 101.5,34.29 101.35,34.14 100.89,34.14 | 101.5,34.29 101.8,34.59 101.8,35.66 100.74,36.73 99.97,36.73 U$49.P$30 | U$49.P$69 113.23,35.81 112.32,35.81 112.17,35.97 112.17,36.88 112.47,37.19 113.23,37.19 U$49.P$72 113.39,37.34 114.15,37.34 114.3,37.49 114.3,37.95
  Top 0.152: 114.3,37.95 114,38.25 113.39,38.25 U$49.P$74 113.23,38.25 112.01,38.25 111.86,38.41 111.25,38.41 110.95,38.1 110.95,32.77 115.82,27.89 126.19,27.89 126.95,27.13 126.95,23.62 123.9,20.57 123.9,14.33 | 126.8,14.33 126.8,15.24 1UF15.P$2 126.64,15.24 126.64,15.54 124.82,17.37 124.82,19.05 1UF14.P$2 | 126.8,14.33 126.8,11.43 U$51.P$2 | 126.8,14.33 123.9,14.33 | 123.9,14.33 120.24,14.33 105.61,28.96 105.61,29.72 U$49.P$49 105.46,29.87 105.16,29.87 U$49.P$48 105,29.87 105,30.79 v104.7,31.09 | v102.11,33.68 101.5,34.29 | v54.41,14.02 51.66,16.76 U$4.P$3 | v60.2,12.8 61.57,11.43 100Ω.P$2 61.72,11.28 62.94,10.06 69.65,10.06 70.87,11.28 73,11.28 100KΩ.P$2 | v119.94,58.52 120.7,59.28 | 114.3,37.95 v114.61,38.25
  Bottom 0.152: v77.27,86.26 82.14,86.26 v82.3,86.41 83.06,85.65 94.49,85.65 100.13,80.01 v100.13,79.7 103.94,75.89 v115.21,75.89 | v104.7,31.09 103.78,32 | 103.78,32 v102.11,33.68 | 60.05,12.95 58.98,14.02 v54.41,14.02 21.18,14.02 18.59,11.43 +.1 | 103.78,32 100.43,28.65 100.13,28.65 96.47,24.99 96.47,16 93.42,12.95 60.05,12.95 | 60.05,12.95 v60.2,12.8 | v119.94,58.52 119.94,58.06 116.13,54.25 116.13,43.13 114,41 114,38.86 v114.61,38.25
N$2
  Top 0.152: 67.21,12.65 68.43,11.43 100KΩ.P$1 | 67.21,12.65 66.45,13.41 53.8,13.41 50.44,16.76 49.99,16.76 U$4.P$1 | 67.21,12.65 69.8,15.24 69.8,15.7 71.93,17.83 72.24,17.83 83.52,29.11 85.65,29.11 2KΩ.P$2
N$3  (via drill 0.35)
  Top 0.152: v82.3,87.33 93.88,87.33 94.94,86.26 94.94,85.19 U$61.P$1 | v77.42,87.63 77.42,88.24 67.67,97.99 62.33,97.99 57.15,92.81 U$62.P$1
  Bottom 0.152: v82.3,87.33 77.72,87.33 v77.42,87.63
N$4
  Top 0.152: U$4.P$2 50.75,18.75 42.37,18.75 41.3,17.68 41.3,12.65 42.52,11.43 75Ω.P$2
N$5  (via drill 0.35)
  Top 0.152: 21.64,12.65 20.42,11.43 +.2 | 21.64,12.65 22.25,13.26 | 22.25,13.26 25.45,16.46 26.52,16.46 U$8.P$1 | 21.64,12.65 +1.1 | v66.9,16.46 61.72,16.46 100Ω1.P$2 | v71.48,16.46 73,16.46 100KΩ1.P$2 73.15,16.46 73.15,13.72 74.37,12.5 74.37,10.21 73.91,9.75 60.81,9.75 58.37,12.19 58.37,12.65 58.22,12.8 52.73,12.8 51.66,11.73 U$1.P$3 51.51,11.58 51.05,11.58 49.53,10.06 39.32,10.06 38.1,11.28 75Ω.P$1 37.95,11.28 36.73,10.06 25.45,10.06 22.25,13.26
  Bottom 0.152: v71.48,16.46 v66.9,16.46
N$6
  Top 0.152: 100KΩ3.P$2 73,26.52 70.87,26.52 69.65,25.3 62.94,25.3 61.72,26.52 100Ω3.P$2 61.57,26.67 60.2,28.04 56.08,28.04 55.02,26.98 51.66,26.98 U$10.P$3 51.51,26.82 51.05,26.82 48.31,24.08 40.54,24.08 38.1,21.64 75Ω2.P$1 37.95,21.64 35.97,21.64 34.59,23.01 28.04,23.01 26.67,21.64 U$9.P$1 26.52,21.64 20.42,21.64 +2.2 17.83,24.08 17.83,26.67 +3.1
N$8
  Top 0.152: U$1.P$1 49.99,11.73 51.21,12.95 51.36,12.95 51.51,13.11 51.51,14.17 49.68,16 49.53,16 49.23,16.31 49.23,17.37 49.68,17.83 67.21,17.83 68.43,16.61 100KΩ1.P$1 68.58,16.61 70.1,18.14 72.08,18.14 85.65,31.7 85.65,34.29 2KΩ1.P$2
N$10
  Top 0.152: U$1.P$2 50.75,13.72 45.41,13.72 42.67,16.46 75Ω1.P$2
N$11
  Top 0.152: 100KΩ2.P$2 73,21.49 71.48,21.49 69.8,19.81 63.4,19.81 61.72,21.49 100Ω2.P$2 61.57,21.49 60.2,20.12 55.93,20.12 54.25,21.79 51.66,21.79 U$6.P$3 51.51,21.79 51.21,21.49 51.21,21.34 48.92,19.05 40.54,19.05 38.1,16.61 75Ω1.P$1 37.95,16.46 37.49,16 33.22,16 31.09,13.87 | 20.27,17.83 20.27,19.05 17.83,21.49 +2.1 | 20.27,17.83 20.27,16.61 +1.2 | 31.09,13.87 28.65,11.43 26.67,11.43 U$3.P$1 | 20.27,17.83 27.74,17.83 29.87,15.7 29.87,15.09 31.09,13.87
N$14
  Top 0.152: U$6.P$1 49.99,21.95 50.9,22.86 55.47,22.86 55.93,23.32 66.75,23.32 68.43,21.64 100KΩ2.P$1 68.58,21.64 71.63,24.69 73.61,24.69 74.37,25.45 74.37,25.91 85.65,37.19 85.65,39.32 2KΩ2.P$2
N$16
  Top 0.152: U$6.P$2 50.75,23.77 44.81,23.77 42.67,21.64 75Ω2.P$2
N$20
  Top 0.152: U$10.P$1 49.99,26.98 50.44,26.98 51.82,28.35 66.75,28.35 68.43,26.67 100KΩ3.P$1 68.58,26.67 70.41,26.67 85.65,41.91 85.65,44.35 2KΩ3.P$2
N$22
  Top 0.152: U$10.P$2 50.75,28.8 44.81,28.8 42.67,26.67 75Ω3.P$2
N$26  (via drill 0.35)
  Top 0.152: v49.99,30.94 49.99,32 U$13.P$1 | v66.9,30.94 67.67,30.94 68.43,31.7 100KΩ4.P$1 68.58,31.85 70.56,31.85 85.34,46.63 v95.86,46.63 | v106.07,46.79 106.07,55.78 2KΩ4.P$2
  Bottom 0.152: v66.9,30.94 v49.99,30.94 | v106.07,46.79 96.01,46.79 v95.86,46.63
N$28
  Top 0.152: U$13.P$2 50.75,33.98 44.81,33.98 42.67,31.85 75Ω4.P$2
N$32  (via drill 0.35)
  Top 0.152: U$16.P$1 49.99,37.19 50.44,37.19 51.36,38.1 55.93,38.1 56.08,38.25 v67.06,38.25 68.43,36.88 100KΩ5.P$1 | v106.68,52.27 107.44,53.03 107.44,57 106.22,58.22 106.22,60.81 2KΩ5.P$2 | v76.81,52.43 v88.24,52.43
  Bottom 0.152: v106.68,52.27 103.17,52.27 97.69,57.76 97.69,60.05 90.98,66.75 89.46,66.75 88.24,65.53 v88.24,52.43 | v76.81,52.43 73,52.43 67.06,46.48 v67.06,38.25
N$34
  Top 0.152: U$16.P$2 50.75,39.01 44.81,39.01 42.67,36.88 75Ω5.P$2
N$35
  Top 0.152: 100KΩ6.P$2 73,41.91 71.02,41.91 69.65,43.28 63.09,43.28 61.72,41.91 100Ω6.P$2 61.57,41.91 60.2,43.28 56.08,43.28 55.02,42.22 51.66,42.22 U$19.P$3 51.51,42.06 51.05,42.06 48.31,39.32 40.54,39.32 38.1,36.88 75Ω5.P$1 37.95,36.88 33.98,36.88 32.31,38.56 28.35,38.56 26.67,36.88 U$18.P$1 26.52,36.88 20.42,36.88 +5.2 17.83,39.32 17.83,41.91 +6.1
N$38  (via drill 0.35)
  Top 0.152: 74.37,42.98 73.76,43.59 55.93,43.59 55.47,43.13 51.36,43.13 50.44,42.22 49.99,42.22 U$19.P$1 | 74.37,42.98 74.37,40.69 74.22,40.54 69.8,40.54 68.58,41.76 100KΩ6.P$1 | v105.46,47.55 105.46,50.14 104.85,50.75 104.85,62.18 106.07,63.4 106.07,65.99 2KΩ6.P$2 | v95.56,47.55 78.94,47.55 74.37,42.98
  Bottom 0.152: v95.56,47.55 v105.46,47.55
N$40
  Top 0.152: U$19.P$2 50.75,44.04 44.81,44.04 42.67,41.91 75Ω6.P$2
N$44  (via drill 0.35)
  Top 0.152: U$22.P$1 49.99,47.4 50.6,47.4 51.36,48.16 55.47,48.16 55.93,48.62 66.9,48.62 68.43,47.09 100KΩ7.P$1 68.58,47.09 v71.17,49.68 | v107.44,68.12 106.22,69.34 106.22,71.02 2KΩ7.P$2 | v102.87,63.55 101.8,63.55 99.82,61.57 v99.82,51.21 | v81.53,49.68 v95.56,49.68
  Bottom 0.152: v102.87,63.55 v107.44,68.12 | v99.82,51.21 97.08,51.21 v95.56,49.68 | v71.17,49.68 v81.53,49.68
N$46
  Top 0.152: U$22.P$2 50.75,49.23 44.81,49.23 42.67,47.09 75Ω7.P$2
N$50  (via drill 0.35)
  Top 0.152: v50.75,51.51 49.99,52.27 U$25.P$1 | v66.9,51.51 67.97,51.51 68.43,51.97 100KΩ8.P$1 68.58,51.97 69.95,50.6 74.07,50.6 76.5,53.03 94.03,53.03 99.67,47.4 v99.67,46.02 | v115.21,69.34 116.13,70.26 116.13,71.02 2KΩ8.P$2 | v108.97,69.34 108.97,66.45 107.75,65.23 107.75,51.05 106.68,49.99 106.68,46.48 106.22,46.02 v105.46,46.02
  Bottom 0.152: v66.9,51.51 v50.75,51.51 | v108.97,69.34 v115.21,69.34 | v99.67,46.02 v105.46,46.02
N$52
  Top 0.152: U$25.P$2 50.75,54.41 44.96,54.41 42.67,52.12 75Ω8.P$2
N$53
  Top 0.152: 100KΩ9.P$2 73,57.15 71.02,57.15 69.65,58.52 63.09,58.52 61.72,57.15 100Ω9.P$2 61.57,57.15 60.2,58.52 56.08,58.52 55.02,57.45 51.66,57.45 U$28.P$3 51.51,57.3 51.51,56.39 49.84,54.71 40.69,54.71 38.1,52.12 75Ω8.P$1 37.95,52.12 35.97,52.12 34.59,53.49 28.04,53.49 26.67,52.12 U$27.P$1 26.52,52.12 20.42,52.12 +8.2 17.83,54.56 17.83,57.15 +9.1
N$56  (via drill 0.35)
  Top 0.152: v50.75,56.54 49.99,57.3 U$28.P$1 | v66.9,56.54 67.97,56.54 68.43,57 100KΩ9.P$1 68.58,57 70.56,57 74.22,53.34 94.18,53.34 100.28,47.24 100.28,45.72 99.82,45.26 99.82,43.13 105,37.95 105,35.2 101.19,31.39 101.19,28.65 102.26,27.58 102.26,13.11 105,10.36 126.95,10.36 127.56,10.97 127.56,46.94 126.34,48.16 124.21,48.16 119.33,53.03 119.33,62.64 116.28,65.68 116.28,65.99 2KΩ9.P$2
  Bottom 0.152: v66.9,56.54 v50.75,56.54
N$58
  Top 0.152: U$28.P$2 50.75,59.28 44.81,59.28 42.67,57.15 75Ω9.P$2
N$59
  Top 0.152: 100KΩ10.P$2 73,62.33 70.87,62.33 69.65,63.55 62.94,63.55 61.72,62.33 100Ω10.P$2 61.57,62.33 60.35,63.55 56.08,63.55 55.17,62.64 51.66,62.64 U$31.P$3 51.51,62.48 51.21,62.48 48.31,59.59 40.54,59.59 38.1,57.15 75Ω9.P$1 37.95,57.15 35.97,57.15 34.59,58.52 28.04,58.52 26.67,57.15 U$30.P$1 26.52,57.15 +9.2 20.27,57.15 17.83,59.59 17.83,62.18 +10.1
N$62  (via drill 0.35)
  Top 0.152: 74.37,61.11 74.37,63.4 73.91,63.86 51.82,63.86 50.6,62.64 49.99,62.64 U$31.P$1 | 74.37,61.11 74.07,60.81 69.95,60.81 68.58,62.18 100KΩ10.P$1 | v115.52,46.63 117.5,48.62 117.5,57.76 116.28,58.98 116.28,60.81 2KΩ10.P$2 | v114.3,45.41 114.3,45.11 109.12,39.93 103.48,39.93 100.13,43.28 100.13,45.11 100.58,45.57 100.58,47.4 94.34,53.65 87.33,53.65 83.06,57.91 77.57,57.91 74.37,61.11
  Bottom 0.152: v114.3,45.41 v115.52,46.63
N$64
  Top 0.152: U$31.P$2 50.75,64.47 44.81,64.47 42.67,62.33 75Ω10.P$2
N$68  (via drill 0.35)
  Top 0.152: v62.48,69.04 55.93,69.04 55.47,68.58 51.36,68.58 50.44,67.67 49.99,67.67 U$34.P$1 49.84,67.51 47.55,65.23 v40.08,65.23 | v64.16,67.36 68.43,67.36 100KΩ11.P$1 | v116.28,58.06 116.28,55.93 2KΩ11.P$2 | v125.12,97.54 122.22,97.54 114.91,104.85 v63.25,104.85
  Bottom 0.152: v64.16,67.36 v62.48,69.04 | v116.28,58.06 116.28,63.86 128.17,75.74 128.17,94.49 v125.12,97.54 | v63.25,104.85 63.25,104.39 40.08,81.23 v40.08,65.23
N$70
  Top 0.152: U$34.P$2 50.75,69.49 44.81,69.49 42.67,67.36 75Ω11.P$2
N$74  (via drill 0.35)
  Top 0.152: 100KΩ12.P$1 68.58,72.24 69.8,71.02 74.22,71.02 74.37,71.17 74.37,73.46 73.76,74.07 55.93,74.07 55.47,73.61 51.36,73.61 50.44,72.69 49.99,72.69 U$37.P$1 49.84,72.54 47.7,70.41 v46.48,70.41 | v131.22,75.89 126.49,71.17 2KΩ12.P$2
  Bottom 0.152: v131.22,75.89 131.22,97.99 124.66,104.55 63.86,104.55 46.48,87.17 v46.48,70.41
N$76
  Top 0.152: U$37.P$2 50.75,74.52 44.81,74.52 42.67,72.39 75Ω12.P$2
N$77
  Top 0.152: +12.2 26.52,72.39 U$39.P$1 26.67,72.39 28.04,73.76 34.59,73.76 35.97,72.39 37.95,72.39 75Ω12.P$1
N$80  (via drill 0.35)
  Top 0.152: v49.99,78.79 49.99,77.88 U$40.P$1 | v65.68,78.18 67.82,78.18 68.43,77.57 100KΩ13.P$1 | v126.34,76.2 125.12,74.98 125.12,69.95 126.34,68.73 126.34,66.14 2KΩ13.P$2 | v126.34,92.05 124.66,92.05 119.63,97.08 119.63,99.67 114.76,104.55 65.68,104.55 v53.03,91.9
  Bottom 0.152: v65.68,78.18 65.08,78.79 v49.99,78.79 47.7,81.08 47.7,86.56 v53.03,91.9 | v126.34,92.05 v126.34,76.2
N$82
  Top 0.152: U$40.P$2 50.75,79.7 44.81,79.7 42.67,77.57 75Ω13.P$2
N$83
  Top 0.152: +13.2 20.42,77.42 26.52,77.42 U$42.P$1 26.67,77.57 27.89,78.79 34.75,78.79 35.97,77.57 37.95,77.57 75Ω13.P$1
N$86  (via drill 0.35)
  Top 0.152: 62.94,84.28 66.75,84.28 68.43,82.6 100KΩ14.P$1 | 62.94,84.28 55.93,84.28 55.47,83.82 51.36,83.82 50.44,82.91 49.99,82.91 U$43.P$1 | v130.61,65.08 126.49,60.96 2KΩ14.P$2 | v62.18,95.4 61.87,95.4 60.35,93.88 60.35,91.29 62.94,88.7 62.94,84.28
  Bottom 0.152: v130.61,65.08 130.61,98.15 124.51,104.24 71.02,104.24 v62.18,95.4
N$88
  Top 0.152: U$43.P$2 50.75,84.73 44.81,84.73 42.67,82.6 75Ω14.P$2
N$89
  Top 0.152: +14.2 20.42,82.6 26.52,82.6 U$45.P$1 26.67,82.6 28.04,83.97 34.59,83.97 35.97,82.6 37.95,82.6 75Ω14.P$1
N$92  (via drill 0.35)
  Top 0.152: v50.9,88.85 49.99,87.94 U$46.P$1 | 67.21,88.85 68.43,87.63 100KΩ15.P$1 | v130,59.44 126.49,55.93 2KΩ15.P$2 | v69.19,95.1 69.19,90.83 67.21,88.85 | 67.21,88.85 v66.9,88.85
  Bottom 0.152: v66.9,88.85 v50.9,88.85 | v130,59.44 130,98.3 124.97,103.33 84.43,103.33 84.12,103.02 77.11,103.02 v69.19,95.1
N$94
  Top 0.152: U$46.P$2 50.75,89.76 44.81,89.76 42.67,87.63 75Ω15.P$2
N$95
  Top 0.152: 38.1,89 38.1,92.66 U$63.P$1 | 38.1,89 38.1,87.63 75Ω15.P$1 | 20.42,87.63 26.52,87.63 U$48.P$1 26.67,87.63 28.04,89 38.1,89 | 20.42,87.63 20.42,92.66 TOPCELL.1 | 20.42,87.63 +15.2
N$97
  Top 0.152: 100KΩ5.P$2 73,36.73 71.02,36.73 69.65,35.36 63.09,35.36 61.72,36.73 100Ω5.P$2 61.57,36.73 60.2,35.36 55.78,35.36 54.1,37.03 51.66,37.03 U$16.P$3 51.51,37.03 51.51,33.53 51.05,33.07 46.33,33.07 43.28,30.02 30.33,30.02 27.58,32.77 | U$15.P$1 26.52,31.7 20.42,31.7 +4.2 20.27,31.85 17.83,34.29 17.83,36.73 +5.1 | 27.58,32.77 26.67,31.85 U$15.P$1 | 27.58,32.77 27.89,33.07 27.89,35.97 30.18,38.25 32.16,38.25 37.95,32.46 37.95,31.85 75Ω4.P$1 | 27.58,32.77 U$15.P$1
N$99
  Top 0.152: 100KΩ7.P$2 73,46.94 71.02,46.94 69.65,45.57 63.09,45.57 61.72,46.94 100Ω7.P$2 61.57,47.09 60.35,48.31 56.08,48.31 55.17,47.4 51.66,47.4 U$22.P$3 51.51,47.24 51.21,47.24 48.31,44.35 40.54,44.35 38.1,41.91 75Ω6.P$1 37.95,41.91 35.97,41.91 34.59,43.28 28.04,43.28 26.67,41.91 U$21.P$1 26.52,41.91 +6.2 20.27,41.91 17.83,44.35 17.83,46.94 +7.1
N$103
  Top 0.152: 100KΩ11.P$2 73,67.36 71.02,67.36 69.65,68.73 63.09,68.73 61.72,67.36 100Ω11.P$2 61.57,67.36 60.2,68.73 56.08,68.73 55.02,67.67 51.66,67.67 U$34.P$3 51.51,67.51 51.21,67.51 48.46,64.77 40.54,64.77 38.1,62.33 75Ω10.P$1 37.95,62.33 35.2,62.33 33.98,63.55 27.89,63.55 26.67,62.33 U$33.P$1 26.52,62.18 20.42,62.18 +10.2 20.27,62.33 17.83,64.77 17.83,67.21 +11.1
N$105
  Top 0.152: 100KΩ13.P$2 73,77.57 70.87,77.57 69.65,78.79 62.94,78.79 61.72,77.57 100Ω13.P$2 61.57,77.57 60.35,78.79 56.08,78.79 55.17,77.88 51.66,77.88 U$40.P$3 51.66,77.72 49.68,75.74 20.27,75.74 18.59,77.42 17.83,77.42 +13.1
N$106
  Top 0.152: 100KΩ14.P$2 73,82.45 71.02,82.45 69.65,81.08 63.09,81.08 61.72,82.45 100Ω14.P$2 61.57,82.6 60.2,83.97 56.08,83.97 55.02,82.91 51.66,82.91 U$43.P$3 51.51,82.75 49.53,80.77 20.42,80.77 18.75,82.45 17.83,82.45 +14.1
N$107
  Top 0.152: 60.05,89 60.2,89 61.57,87.63 100Ω15.P$2 | 60.05,89 56.08,89 55.02,87.94 51.66,87.94 U$46.P$3 51.51,87.78 48.77,85.04 21.18,85.04 18.59,87.63 +15.1 | 60.05,89 60.05,94.18 61.87,96.01 69.19,96.01 73,92.2 73,87.63 100KΩ15.P$2
N$112  (via drill 0.35)
  Top 0.152: v119.63,11.43 U$51.P$1 | v100.43,27.13 100.43,28.04 97.38,31.09 97.38,34.75 | 97.38,34.75 98.91,36.27 99.82,36.27 U$49.P$31 | v81.08,78.94 80.31,78.18 80.31,77.57 U$52.P$1 | v81.38,73.91 79.55,72.08 v79.55,64.47 | 97.38,34.75 v97.08,35.05
  Bottom 0.152: v119.63,11.43 110.49,20.57 106.98,20.57 v100.43,27.13 | v81.08,78.94 81.08,74.22 v81.38,73.91 | v79.55,64.47 79.55,52.58 v97.08,35.05
N$113  (via drill 0.35)
  Top 0.152: v122.53,67.67 120.55,69.65 120.55,72.24 121.01,72.69 121.01,81.99 118.42,84.58 118.42,85.04 U$50.P$1 | v124.82,65.38 124.82,50.29 v126.34,48.77 | v101.35,27.13 101.35,27.58 97.69,31.24 97.69,34.59 98.91,35.81 99.82,35.81 U$49.P$32
  Bottom 0.152: v124.82,65.38 v122.53,67.67 | v126.34,48.77 126.34,48.16 127.25,47.24 127.25,21.18 126.95,20.88 107.59,20.88 v101.35,27.13
N$114  (via drill 0.35)
  Top 0.152: v122.07,85.19 120.4,85.19 U$50.P$2 | v123.75,86.87 124.36,87.48 125.73,87.48 132.74,80.47 132.74,15.7 127.1,10.06 104.85,10.06 101.96,12.95 101.96,27.43 97.99,31.39 97.99,34.44 98.91,35.36 99.82,35.36 U$49.P$33
  Bottom 0.152: v123.75,86.87 v122.07,85.19
N$123
  Top 0.152: U$49.P$42 102.11,29.72 102.11,28.19 105.31,24.99 105.31,11.43 GPIO_0-6.6
N$124
  Top 0.152: U$49.P$43 102.72,29.72 102.72,28.04 107.9,22.86 107.9,11.43 GPIO_0-6.5
N$125
  Top 0.152: GPIO_0-6.4 110.49,20.73 103.17,28.04 103.17,29.72 U$49.P$44
N$126
  Top 0.152: U$49.P$45 103.63,29.72 103.63,28.04 112.93,18.75 112.93,11.43 GPIO_0-6.3
N$127
  Top 0.152: U$49.P$46 104.09,29.72 104.09,28.04 115.52,16.61 115.52,11.43 GPIO_0-6.2
N$128
  Top 0.152: GPIO_0-6.1 118.11,14.48 104.7,27.89 104.7,29.72 U$49.P$47
N$139  (via drill 0.35)
  Top 0.152: v102.41,69.34 100.89,69.34 100.28,69.95 100.28,71.63 97.38,74.52 97.38,89.76 91.9,95.25 88.39,95.25 81.69,88.54 81.69,84.43 81.99,84.12 83.67,84.12 84.58,85.04 86.56,85.04 U$56.P$1 | v116.13,69.34 116.13,68.43 114.91,67.21 114.91,45.11 110.64,40.84 110.64,31.09 110.19,30.63 110.19,29.87 U$49.P$58
  Bottom 0.152: v102.41,69.34 108.05,69.34 108.66,69.95 115.52,69.95 v116.13,69.34
N$151  (via drill 0.35)
  Top 0.152: v94.03,86.26 94.03,86.11 93.12,85.19 U$61.P$2 | U$60.P$2 114.15,85.04 114.61,84.58 v114.61,83.97 114.61,47.7 v114,47.09 | v114.91,37.03 114.15,36.27 113.39,36.27 U$49.P$70
  Bottom 0.152: v94.03,86.26 94.49,86.26 104.55,76.2 111.1,76.2 114.61,79.7 v114.61,83.97 | v114.91,37.03 113.69,38.25 113.69,46.79 v114,47.09
OUT1  (via drill 0.35)
  Top 0.152: v101.04,44.5 101.19,44.65 101.19,47.7 99.21,49.68 99.21,71.78 96.77,74.22 96.77,77.88 95.1,79.55 95.1,81.23 U$59.P$2 | 111.86,37.8 113.23,37.8 U$49.P$73 | 111.86,37.8 111.86,35.81 112.47,35.2 113.23,35.2 U$49.P$68 | 111.86,37.8 v111.56,37.8
  Bottom 0.152: v101.04,44.5 104.55,44.5 111.25,37.8 v111.56,37.8
TOP  (via drill 0.35)
  Top 0.152: v115.67,39.17 113.39,39.17 U$49.P$76 | v128.78,95.56 125.73,98.6 125.73,99.52 119.79,105.46 55.32,105.46 42.67,92.81 U$63.P$2
  Bottom 0.152: v115.67,39.17 115.67,42.22 128.78,55.32 v128.78,95.56
VDIG  (via drill 0.35)
  Top 0.152: v101.8,31.09 101.65,30.94 101.65,29.87 U$49.P$41 | v101.19,34.9 99.97,34.9 U$49.P$34 99.82,34.75 99.06,34.75 98.6,34.29 v98.6,34.14 | U$54.P$1 86.72,77.57 86.72,81.23 U$55.P$1 86.56,81.38 86.26,81.69 v85.8,81.69 | v78.03,85.65 78.03,88.09 67.82,98.3 60.35,98.3 53.34,91.29 41.45,91.29 41.3,91.44 41.3,91.9 39.17,94.03 30.02,94.03 28.8,92.81 26.67,92.81 U$53.P$1 | v97.08,41.45 97.08,41.76 v98.3,42.98 | v89.76,66.14 89.76,71.93 v89.92,72.08
  Bottom 0.152: v101.8,31.09 101.8,33.07 101.19,33.68 v101.19,34.9 | v78.03,85.65 81.84,85.65 v85.8,81.69 89.92,77.57 v89.92,72.08 | v98.6,34.14 98.6,39.93 v97.08,41.45 | v98.3,42.98 97.99,43.28 97.84,43.28 90.53,50.6 90.53,60.96 89.76,61.72 v89.76,66.14
VREF  (via drill 0.35)
  Top 0.152: U$58.P$2 120.4,81.23 120.4,77.57 U$57.P$2 120.24,77.42 118.57,75.74 118.57,68.43 118.87,68.12 v118.87,65.53 | v118.72,62.33 118.87,62.18 118.87,39.62 114,34.75 113.39,34.75 U$49.P$67
  Bottom 0.152: v118.72,62.33 118.72,65.38 v118.87,65.53
VSENSE0  (via drill 0.35)
  Top 0.152: U$49.P$29 99.82,37.34 98.45,37.34 91.44,30.33 91.44,12.19 89.46,10.21 87.63,10.21 86.41,11.43 VSENSE0.2 86.26,11.43 84.28,9.45 60.66,9.45 58.83,11.28 57.15,11.28 100Ω.P$1 | v98.6,61.42 98.6,58.52 97.54,57.45 97.54,55.93 U$5.P$2
  Bottom 0.152: v98.6,61.42 99.36,61.42 112.47,48.31 112.47,37.34 111.71,36.58 109.73,36.58 105.61,32.46 105.61,30.63 102.72,27.74 100.13,27.74 99.06,26.67 99.06,16 95.71,12.65 87.63,12.65 86.41,11.43 VSENSE0.2
VSENSE1  (via drill 0.35)
  Top 0.152: v36.42,16.61 31.24,16.61 U$8.P$2 | v55.47,16.61 57,16.61 100Ω1.P$1 | v99.36,76.2 99.36,77.42 1UF.P$1 | v97.54,72.54 97.54,71.17 U$2.P$2 97.54,71.02 98.3,70.26 98.3,66.45 96.77,64.92 96.77,58.37 | U$5.P$1 95.25,56.39 96.77,57.91 96.77,58.37 | VSENSE1.2 87.63,15.24 89.31,15.24 90.07,16 90.07,22.71 88.85,23.93 88.85,30.33 v96.62,38.1 96.77,38.25 99.82,38.25 U$49.P$27 | v97.08,58.37 96.77,58.37 | v92.96,49.07 90.83,49.07 v89.92,48.16
  Bottom 0.152: v36.42,16.61 v55.47,16.61 66.14,16.61 66.6,17.07 85.8,17.07 VSENSE1.2 | v99.36,76.2 99.36,74.37 v97.54,72.54 | v97.08,58.37 96.32,58.37 94.49,60.2 93.88,60.2 93.57,59.89 93.57,58.83 94.34,58.06 94.34,52.12 92.96,50.75 v92.96,49.07 | v89.92,48.16 89.92,44.81 v96.62,38.1
VSENSE2  (via drill 0.35)
  Top 0.152: 84.58,76.05 92.81,76.05 94.18,77.42 94.18,78.49 94.49,78.79 95.4,78.79 96.47,77.72 96.47,72.39 95.25,71.17 U$2.P$1 95.25,68.89 v96.47,67.67 | 84.58,76.05 79.86,76.05 79.4,76.5 79.4,78.64 80.16,79.4 80.16,81.23 1UF1.P$1 | v85.19,69.49 85.19,67.36 83.67,65.84 83.67,63.55 U$7.P$2 | 84.58,76.05 v84.58,75.89 | v101.19,38.86 100.74,39.32 99.97,39.32 U$49.P$25 | v40.69,17.22 40.69,16.61 35.51,11.43 31.24,11.43 U$3.P$2 | v55.47,21.49 57,21.49 100Ω2.P$1
  Bottom 0.152: v85.19,69.49 85.19,75.29 v84.58,75.89 | 101.19,37.19 101.19,35.81 95.25,29.87 95.25,21.49 | 101.19,37.19 v101.19,38.86 | VSENSE2.2 95.25,21.49 | v40.69,17.22 51.21,17.22 v55.47,21.49 95.25,21.49 | v96.47,67.67 96.47,62.64 102.72,56.39 103.94,56.39 112.17,48.16 112.17,37.49 111.86,37.19 101.19,37.19
VSENSE3  (via drill 0.35)
  Top 0.152: 48.62,21.79 49.99,23.16 53.65,23.16 57,26.52 100Ω3.P$1 | 48.62,21.79 46.94,20.12 37.03,20.12 35.66,21.49 31.24,21.49 U$9.P$2 | v99.21,80.01 99.21,81.23 1UF2.P$1 | v84.58,68.28 83.67,67.36 U$11.P$2 | U$49.P$23 99.82,40.39 v95.71,40.39 95.25,40.84 89.15,40.84 88.85,40.54 88.85,39.93 84.43,35.51 84.43,35.05 73.76,24.38 73.46,24.38 71.78,22.71 71.78,22.25 69.65,20.12 67.51,20.12 64.62,23.01 56.08,23.01 55.63,22.55 51.05,22.55 50.9,22.4 50.9,21.49 50.44,21.03 49.38,21.03 48.62,21.79 | v81.38,65.08 81.38,63.55 U$7.P$1 | VSENSE3.2 95.25,14.78 96.62,16.15 v96.62,33.68
  Bottom 0.152: v99.21,80.01 87.48,68.28 87.02,68.28 | 87.02,68.28 v84.58,68.28 v81.38,65.08 | 87.02,68.28 87.02,51.97 95.71,43.28 v95.71,40.39 97.69,38.41 97.69,34.75 v96.62,33.68
VSENSE4  (via drill 0.35)
  Top 0.152: 56.08,32.77 49.38,32.77 46.33,29.72 38.71,29.72 35.66,26.67 31.24,26.67 U$12.P$2 | 56.08,32.77 57,31.85 100Ω4.P$1 | 82.14,93.57 VSENSE4.2 82.45,93.88 | 82.14,93.57 80.31,91.75 80.31,85.19 1UF3.P$1 | v93.73,52.43 96.47,49.68 96.47,46.02 99.82,42.67 99.82,41.45 U$49.P$21 | v90.98,65.84 90.53,66.29 90.53,70.41 91.14,71.02 U$14.P$2 | v90.37,62.03 82.91,62.03 81.99,62.94 81.99,65.38 81.38,65.99 81.38,67.21 U$11.P$1 v80.31,68.28 | 82.14,93.57 80.47,95.25 79.55,95.25 78.64,94.34 78.64,81.53 76.2,79.1 v76.2,78.64 | v56.08,34.75 56.08,32.77
  Bottom 0.152: v93.73,52.43 93.73,58.22 90.98,60.96 90.98,62.03 | v90.98,65.84 90.98,62.03 | 90.98,62.03 v90.37,62.03 | v76.2,78.64 76.2,72.39 v80.31,68.28 72.24,60.2 72.24,55.93 56.08,39.78 v56.08,34.75
VSENSE5  (via drill 0.35)
  Top 0.152: v102.26,54.1 102.11,53.95 102.11,43.28 U$49.P$19 | v89.15,69.04 89.15,70.87 U$14.P$1 88.85,71.02 85.8,71.02 84.43,69.65 82.45,69.65 81.69,70.41 81.69,71.02 U$17.P$2 81.53,71.17 80.92,71.17 v80.47,71.63 | v34.59,31.85 31.24,31.85 U$15.P$2 | v55.47,36.58 56.84,36.58 57,36.73 100Ω5.P$1 | v98.6,86.11 99.21,85.5 99.21,85.19 1UF4.P$1
  Bottom 0.152: v102.26,54.1 102.26,55.93 v89.15,69.04 | v34.59,31.85 50.75,31.85 v55.47,36.58 55.47,45.87 50.14,51.21 50.14,59.89 73,82.75 | v98.6,86.11 95.1,86.11 82.6,98.6 82.6,99.06 VSENSE5.2 82.45,99.06 82.45,99.82 81.69,100.58 79.86,100.58 75.44,96.16 75.44,85.19 73,82.75 | v80.47,71.63 80.47,75.29 73,82.75
VSENSE6  (via drill 0.35)
  Top 0.152: U$18.P$2 31.24,36.73 31.24,36.12 37.03,30.33 39.17,30.33 41.3,32.46 41.3,32.92 46.79,38.41 53.65,38.41 57,41.76 100Ω6.P$1 57.15,41.91 v59.13,41.91 | v103.17,49.84 103.17,43.28 U$49.P$17 | 91.9,59.59 91.29,59.59 U$20.P$2 | 91.9,59.59 v94.18,59.59 | 94.18,76.5 91.59,73.91 86.56,73.91 83.82,71.17 | 94.18,76.5 94.94,77.27 94.94,77.42 1UF5.P$1 | v95.56,82.45 95.56,86.11 89,92.66 89,93.88 VSENSE6.2 | 94.18,76.5 v94.49,76.2 | 91.9,59.59 91.9,64.31 91.59,64.62 90.68,64.62 89.61,63.55 89.61,62.64 89.31,62.33 83.06,62.33 82.3,63.09 v82.3,68.12 82.3,68.73 79.86,71.17 79.86,71.93 80.16,72.24 82.75,72.24 83.82,71.17 | 83.82,71.17 U$17.P$1
  Bottom 0.152: v103.17,49.84 102.11,49.84 95.56,56.39 95.56,58.22 v94.18,59.59 | v95.56,82.45 95.56,77.27 v94.49,76.2 | v59.13,41.91 59.13,42.37 78.94,62.18 78.94,64.77 v82.3,68.12
VSENSE7  (via drill 0.35)
  Top 0.152: 1UF6.P$1 114,81.38 114,83.82 113.54,84.28 113.54,95.25 116.74,98.45 116.74,99.67 115.82,100.58 100.13,100.58 99.06,99.52 99.06,98.6 98.3,97.84 92.66,97.84 VSENSE7.2 90.68,99.06 89.46,100.28 85.5,100.28 84.89,99.67 83.67,99.67 83.06,100.28 81.69,100.28 v81.38,99.97 | U$21.P$2 31.24,41.76 35.66,41.76 36.88,40.54 47.09,40.54 49.99,43.43 53.49,43.43 57,46.94 100Ω7.P$1 57.15,46.94 59.13,46.94 60.81,45.26 76.2,45.26 81.38,50.44 v89.92,50.44 | v103.48,41.76 104.09,42.37 104.09,43.13 U$49.P$15 | U$20.P$1 v89.92,58.67 | U$23.P$2 91.14,63.4 91.14,61.87 89,59.74 U$20.P$1 | v84.12,61.42 87.17,61.42 U$20.P$1
  Bottom 0.152: v103.48,41.76 98.6,41.76 v89.92,50.44 v89.92,58.67 | v81.38,99.97 81.38,92.51 75.74,86.87 75.74,80.47 80.77,75.44 80.77,73.15 83.36,70.56 83.36,67.97 80.77,65.38 80.77,64.77 v84.12,61.42
VSENSE8  (via drill 0.35)
  Top 0.152: v114,80.01 114,77.57 1UF7.P$1 | U$24.P$2 31.24,46.94 35.66,46.94 37.03,45.57 46.94,45.57 v49.84,48.46 53.49,48.46 57,51.97 100Ω8.P$1 57.15,51.97 59.28,51.97 60.96,50.29 80.77,50.29 81.53,51.05 v94.18,51.05 | v104.55,41.76 105,42.22 105,43.13 U$49.P$13 | v94.94,57.91 94.94,59.13 95.4,59.59 U$26.P$2 95.4,59.74 95.4,61.27 91.75,64.92 90.37,64.92 89,63.55 U$23.P$1
  Bottom 0.152: v114,80.01 114,80.31 101.8,92.51 | VSENSE8.2 101.8,92.51 | v104.55,41.76 102.41,43.89 97.69,43.89 94.94,46.63 94.94,51.05 | v94.94,57.91 94.94,51.05 | 94.94,51.05 v94.18,51.05 | 101.8,92.51 107.9,98.6 107.9,99.52 106.22,101.19 79.55,101.19 69.34,90.98 69.34,80.92 49.84,61.42 v49.84,48.46
VSENSE9  (via drill 0.35)
  Top 0.152: 49.68,53.34 49.99,53.65 53.65,53.65 57,57 100Ω9.P$1 | 49.68,53.34 46.94,50.6 37.03,50.6 35.66,51.97 31.24,51.97 U$27.P$2 | 97.69,62.33 97.69,63.25 97.54,63.4 U$29.P$2 | 97.69,62.33 97.69,59.74 U$26.P$1 | 108.36,59.28 108.36,50.75 107.9,50.29 107.9,46.79 106.07,44.96 106.07,43.28 U$49.P$11 | 108.36,59.28 108.36,63.7 109.58,64.92 109.58,70.1 105.77,73.91 105.77,77.42 1UF8.P$1 105.77,77.57 106.38,78.18 v106.38,82.6 | v98.6,62.33 97.69,62.33 | 108.36,59.28 v108.66,59.28 | v49.23,53.8 49.68,53.34 | v94.03,102.72 97.69,99.06 VSENSE9.2
  Bottom 0.152: v98.6,62.33 99.82,62.33 102.87,59.28 v108.66,59.28 | v106.38,82.6 99.06,89.92 99.06,94.49 97.84,95.71 97.84,99.06 VSENSE9.2 | v49.23,53.8 49.23,79.1 47.4,80.92 47.4,87.17 54.71,94.49 71.48,94.49 79.7,102.72 v94.03,102.72
VSENSE10  (via drill 0.35)
  Top 0.152: 72.85,59.74 72.08,60.5 58.83,60.5 57.15,62.18 100Ω10.P$1 57,62.18 53.49,58.67 49.99,58.67 47.09,55.78 36.88,55.78 35.66,57 31.24,57 U$30.P$2 | 72.85,59.74 77.88,54.71 81.69,54.71 82.75,55.78 83.52,55.78 U$32.P$2 | 100.89,76.66 99.82,77.72 99.82,78.49 98.6,79.7 98.6,83.06 100.74,85.19 100.74,87.94 106.68,93.88 VSENSE10.2 | 100.89,76.66 101.04,76.5 101.65,76.5 101.96,76.81 101.96,82.75 105.31,86.11 105.92,86.11 106.22,85.8 106.22,83.36 105.77,82.91 105.77,81.38 1UF9.P$1 | v106.98,44.5 106.98,43.28 U$49.P$9 | U$29.P$1 v95.25,64.92 94.49,65.68 94.49,69.34 91.14,72.69 87.02,72.69 84.28,69.95 83.36,69.95 83.06,70.26 v82.75,70.26 | v100.43,76.2 100.89,76.66 | v72.85,59.89 72.85,59.74
  Bottom 0.152: v106.98,44.5 108.66,44.5 111.25,47.09 111.56,47.09 111.86,47.4 111.86,48.01 103.78,56.08 102.56,56.08 95.25,63.4 95.25,64.62 | v100.43,76.2 100.43,74.37 93.27,67.21 93.27,66.6 95.25,64.62 | 95.25,64.62 v95.25,64.92 | v72.85,59.89 82.75,69.8 v82.75,70.26
VSENSE11  (via drill 0.35)
  Top 0.152: v81.23,57.3 81.23,55.93 U$32.P$1 | U$35.P$2 81.69,59.59 v80.62,58.52 79.7,58.52 72.39,65.84 58.52,65.84 57.15,67.21 100Ω11.P$1 57,67.21 55.47,67.21 | 55.47,67.21 54.71,67.21 51.21,63.7 49.84,63.7 46.94,60.81 36.27,60.81 34.9,62.18 31.24,62.18 U$33.P$2 | 101.19,75.59 102.26,76.66 102.26,79.86 105.61,83.21 105.61,85.04 1UF10.P$1 | 101.19,75.59 99.06,75.59 97.99,76.66 97.99,89.92 106.68,98.6 VSENSE11.2 | v108.2,41.76 108.2,43.13 U$49.P$7 | v105.16,44.81 105.16,45.41 104.85,45.72 104.85,50.29 104.39,50.75 104.39,72.39 101.19,75.59 | v55.47,66.14 55.47,67.21
  Bottom 0.152: v81.23,57.3 81.23,57.91 v80.62,58.52 | v105.16,44.81 v108.2,41.76 | v55.47,66.14 55.47,66.6 75.13,86.26 75.13,96.32 79.7,100.89 104.85,100.89 VSENSE11.2
VSENSE12  (via drill 0.35)
  Top 0.152: v124.66,86.87 124.66,85.19 1UF11.P$1 | 81.69,81.38 81.69,83.97 81.38,84.28 81.38,91.14 83.82,93.57 83.82,94.49 80.47,97.84 79.55,97.84 78.79,98.6 78.79,99.52 83.52,104.24 114.61,104.24 119.33,99.52 119.33,95.25 118.11,94.03 VSENSE12.2 | 81.69,81.38 81.69,77.57 U$38.P$2 | U$36.P$2 31.24,67.21 35.66,67.21 37.03,65.84 46.94,65.84 49.99,68.89 53.65,68.89 57,72.24 100Ω12.P$1 57.15,72.24 59.28,72.24 61.87,69.65 73.15,69.65 78.33,64.47 78.33,63.86 v81.08,61.11 | v103.78,40.54 107.9,40.54 109.12,41.76 109.12,43.13 U$49.P$5 | 83.82,59.59 v87.63,55.78 | 83.82,59.59 v82.6,59.59 | 83.82,59.59 U$35.P$1 | v81.38,81.38 81.69,81.38 | v86.41,62.94 v86.41,68.89
  Bottom 0.152: v124.66,86.87 124.66,87.33 118.11,93.88 VSENSE12.2 | v103.78,40.54 98.91,40.54 87.63,51.82 v87.63,55.78 | v81.08,61.11 v82.6,59.59 83.21,59.59 84.73,61.11 84.73,61.27 v86.41,62.94 | v81.38,81.38 89.15,73.61 89.15,71.63 v86.41,68.89
VSENSE13  (via drill 0.35)
  Top 0.152: 78.94,80.01 78.79,79.86 78.33,79.86 74.52,76.05 58.52,76.05 57.15,77.42 100Ω13.P$1 57,77.42 53.49,73.91 49.99,73.91 47.09,71.02 36.88,71.02 35.66,72.24 31.24,72.24 U$39.P$2 | 78.94,80.01 79.25,80.31 79.25,81.53 80.01,82.3 80.62,82.3 80.77,82.14 80.77,79.55 79.7,78.49 79.7,76.66 80.01,76.35 82.45,76.35 83.52,77.42 83.82,77.42 U$38.P$1 | v124.82,79.4 124.82,77.57 1UF12.P$1 | v113.08,54.1 110.19,51.21 110.19,43.28 U$49.P$3 | v97.54,68.73 97.54,67.36 U$41.P$2 | 78.94,80.01 79.25,79.7 79.25,78.94 79.1,78.79 79.1,76.35 80.16,75.29 92.51,75.29 94.49,77.27 94.49,78.33 94.64,78.49 95.25,78.49 95.86,77.88 v95.86,75.74
  Bottom 0.152: VSENSE13.2 118.11,98.6 125.27,91.44 125.27,86.56 124.82,86.11 v124.82,79.4 124.82,73.46 115.52,64.16 | v113.08,54.1 113.08,61.72 115.52,64.16 | 101.04,68.73 110.95,68.73 115.52,64.16 | 101.04,68.73 v97.54,68.73 | v95.86,75.74 97.99,75.74 99.06,76.81 100.74,76.81 101.04,76.5 101.04,68.73
VSENSE14  (via drill 0.35)
  Top 0.152: U$42.P$2 31.24,77.42 35.66,77.42 37.03,76.05 49.53,76.05 50.9,77.42 50.9,78.18 55.17,82.45 57,82.45 100Ω14.P$1 57.15,82.45 59.28,82.45 60.96,80.77 76.5,80.77 v78.03,82.3 | VSENSE14.2 125.73,95.25 127.41,95.25 128.17,94.49 128.17,92.51 123.14,87.48 123.14,85.34 124.66,83.82 124.66,81.38 1UF13.P$1 124.66,81.23 124.66,80.16 123.44,78.94 v123.44,61.57 | 111.1,45.87 111.1,46.02 110.95,46.18 110.95,47.4 v111.25,47.7 | 111.1,45.87 111.1,43.28 U$49.P$1 | 94.49,54.56 92.51,54.56 91.29,55.78 U$44.P$2 | 94.49,54.56 v98.3,54.56 | 94.49,54.56 94.49,56.69 94.79,57 95.4,57 96.47,58.06 96.47,64.62 95.25,65.84 U$41.P$1 95.25,67.36 94.94,67.67 94.94,69.34 90.98,73.3 v88.54,73.3 | v114,48.01 111.86,45.87 111.1,45.87
  Bottom 0.152: v111.25,47.7 106.22,47.7 99.36,54.56 v98.3,54.56 | v123.44,61.57 122.07,61.57 114.61,54.1 114.61,48.62 v114,48.01 | v78.03,82.3 79.55,82.3 v88.54,73.3
VSENSE15  (via drill 0.35)
  Top 0.152: U$45.P$2 31.24,82.45 35.66,82.45 37.03,81.08 46.94,81.08 49.99,84.12 53.65,84.12 57,87.48 100Ω15.P$1 57.15,87.63 v60.05,87.63 | 91.59,66.9 91.59,65.53 96.16,60.96 96.16,58.22 95.25,57.3 90.98,57.3 89.61,55.93 89,55.93 U$44.P$1 | 91.59,66.9 91.29,67.21 U$47.P$2 | v126.64,21.49 126.64,19.05 1UF14.P$1 | v114.61,40.39 114.3,40.69 113.39,40.69 U$49.P$79 | v93.88,66.9 91.59,66.9 | v121.31,102.11 124.36,99.06 VSENSE15.2
  Bottom 0.152: v126.64,21.49 115.52,32.61 115.52,36.42 | 115.52,36.42 115.52,38.41 114.61,39.32 v114.61,40.39 | 113.69,53.49 113.69,49.53 113.39,49.23 113.39,37.64 114.61,36.42 115.52,36.42 | 113.69,53.49 113.69,61.72 125.73,73.76 125.73,94.49 124.51,95.71 124.51,99.06 VSENSE15.2 | v93.88,66.9 94.79,66.9 96.16,68.28 97.08,68.28 102.41,62.94 105.77,62.94 107.59,64.77 112.17,64.77 112.47,64.47 112.47,53.8 112.78,53.49 113.69,53.49 | v60.05,87.63 66.6,87.63 68.73,89.76 68.73,91.29 79.55,102.11 v121.31,102.11
VSENSE16  (via drill 0.35)
  Top 0.152: 1UF15.P$1 124.66,15.24 124.66,17.07 124.21,17.53 124.21,20.42 127.25,23.47 127.25,45.41 125.73,46.94 J1.1 | v118.11,39.78 113.39,39.78 U$49.P$77 | v85.95,70.26 U$47.P$1 | v76.35,81.69 73.15,84.89 v63.55,84.89 | v48.31,85.65 33.07,85.65 31.24,87.48 U$48.P$2
  Bottom 0.152: v118.11,39.78 118.57,39.78 125.73,46.94 J1.1 125.73,51.82 129.39,55.47 129.39,98.45 126.34,101.5 79.4,101.5 69.04,91.14 69.04,89.61 64.31,84.89 v63.55,84.89 49.07,84.89 v48.31,85.65 | v85.95,70.26 85.95,75.44 79.7,81.69 v76.35,81.69